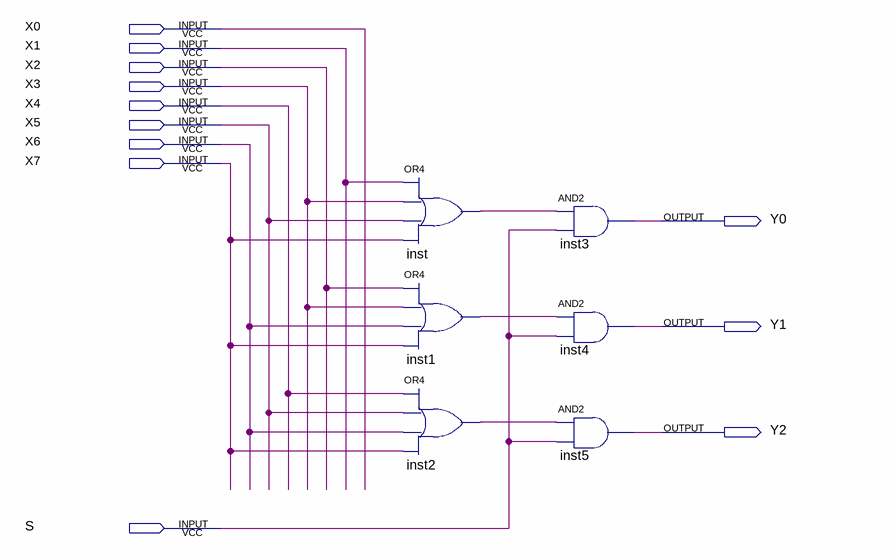
[diagram p0: schematic sheet]
// Quartus schematic Labus1.bdf as structural Verilog: 6 symbols, 12 pins
module Labus1 (
  input  X0,
  input  X1,
  input  X2,
  input  X3,
  input  X4,
  input  X5,
  input  X6,
  input  X7,
  input  S,
  output Y0,
  output Y1,
  output Y2
);

  wire inst1_out, inst2_out, inst_out;

  or inst (inst_out, X1, X3, X5, X7);
  or inst1 (inst1_out, X2, X3, X6, X7);
  or inst2 (inst2_out, X4, X5, X6, X7);
  and inst3 (Y0, inst_out, S);
  and inst4 (Y1, inst1_out, S);
  and inst5 (Y2, inst2_out, S);
endmodule
